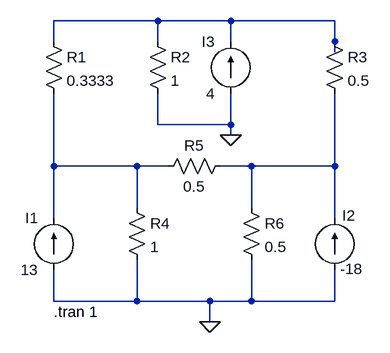
[diagram p0: schematic g3_p6.asc]
g3_p6.asc, the LTspice schematic file:
Version 4
SHEET 1 880 680
WIRE 112 -128 -48 -128
WIRE 224 -128 112 -128
WIRE 384 -128 224 -128
WIRE -48 -96 -48 -128
WIRE 112 -96 112 -128
WIRE 224 -96 224 -128
WIRE 384 -96 384 -128
WIRE 384 -80 384 -96
WIRE 112 32 112 -16
WIRE 224 32 224 -16
WIRE 224 32 112 32
WIRE 224 48 224 32
WIRE -48 96 -48 -16
WIRE 80 96 -48 96
WIRE 128 96 80 96
WIRE 256 96 208 96
WIRE 384 96 384 -16
WIRE 384 96 256 96
WIRE 80 160 80 96
WIRE 256 160 256 96
WIRE -48 176 -48 96
WIRE 384 176 384 96
WIRE -48 304 -48 256
WIRE 80 304 80 240
WIRE 80 304 -48 304
WIRE 192 304 80 304
WIRE 256 304 256 240
WIRE 256 304 192 304
WIRE 384 304 384 256
WIRE 384 304 256 304
WIRE 192 336 192 304
FLAG 192 336 0
FLAG 224 48 0
SYMBOL res 240 144 R0
SYMATTR InstName R6
SYMATTR Value 0.5
SYMBOL res 64 144 R0
SYMATTR InstName R4
SYMATTR Value 1
SYMBOL res 224 80 R90
WINDOW 0 0 56 VBottom 2
WINDOW 3 32 56 VTop 2
SYMATTR InstName R5
SYMATTR Value 0.5
SYMBOL current -48 256 R180
WINDOW 0 24 80 Left 2
WINDOW 3 24 0 Left 2
WINDOW 123 0 0 Left 0
WINDOW 39 0 0 Left 0
SYMATTR InstName I1
SYMATTR Value 13
SYMBOL current 384 256 R180
WINDOW 0 -32 84 Left 2
WINDOW 3 -44 2 Left 2
WINDOW 123 0 0 Left 0
WINDOW 39 0 0 Left 0
SYMATTR InstName I2
SYMATTR Value -18
SYMBOL res -64 -112 R0
SYMATTR InstName R1
SYMATTR Value 0.3333
SYMBOL res 96 -112 R0
SYMATTR InstName R2
SYMATTR Value 1
SYMBOL res 368 -112 R0
SYMATTR InstName R3
SYMATTR Value 0.5
SYMBOL current 224 -16 R180
WINDOW 0 24 80 Left 2
WINDOW 3 24 0 Left 2
SYMATTR InstName I3
SYMATTR Value 4
TEXT -48 320 Left 2 !.tran 1

The netlist it stands for:
* g3_p6.asc
R6 N003 0 0.5
R4 N002 0 1
R5 N003 N002 0.5
I1 0 N002 13
I2 0 N003 -18
R1 N001 N002 0.3333
R2 N001 0 1
R3 N001 N003 0.5
I3 0 N001 4
.tran 1
.backanno
.end